# EAGLE design me433 (EAGLE 9.6.2)
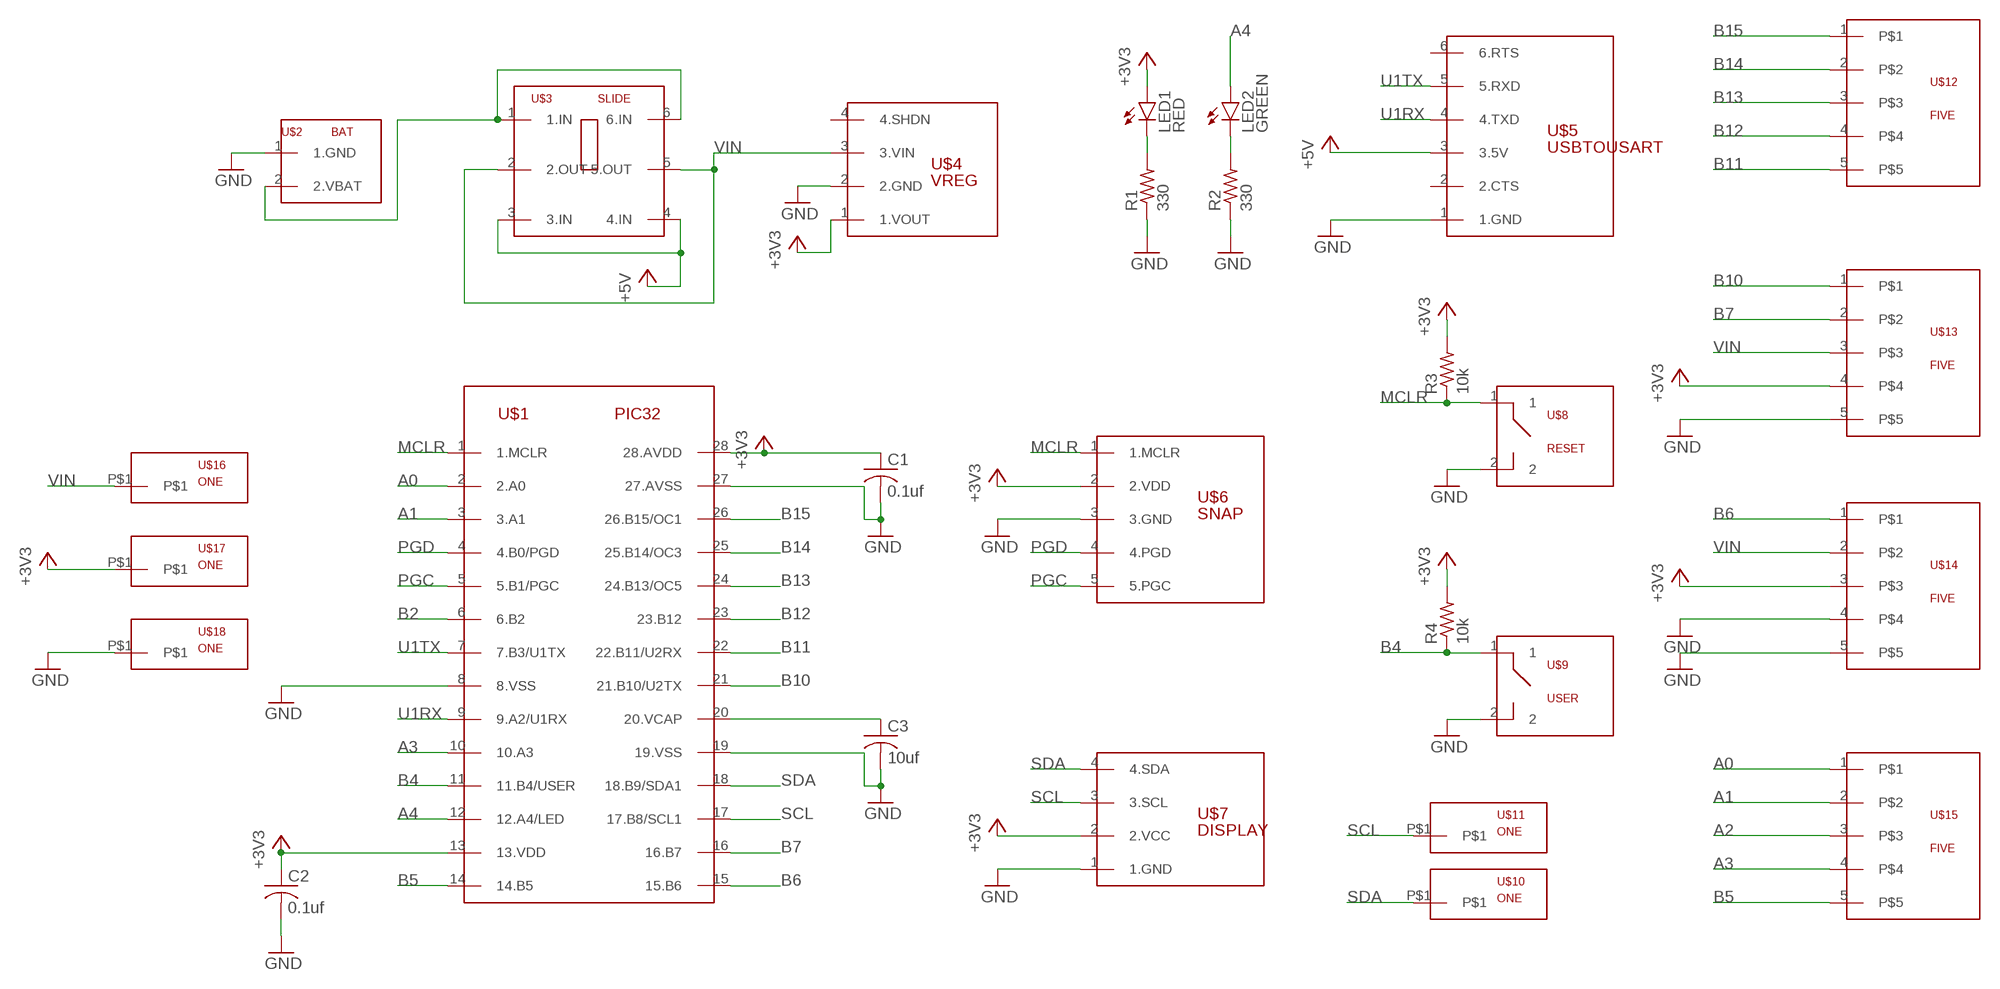
[diagram p0: schematic, sheet 1]

## Parts
C1  0.1uf  C-US025-024X044  [C025-024X044]
C2  0.1uf  C-US025-024X044  [C025-024X044]
C3  10uf  C-US025-024X044  [C025-024X044]
LED1  RED  LED3MM  [LED3MM]
LED2  GREEN  LED3MM  [LED3MM]
R1  330  R-US_0207/7  [0207/7]
R2  330  R-US_0207/7  [0207/7]
R3  10k  R-US_0207/7  [0207/7]
R4  10k  R-US_0207/7  [0207/7]
U$1  PIC32  [DIL28-3]
U$2  BAT  [BAT]
U$3  SLIDE  [SLIDE]
U$4  VREG  [VREG]
U$5  USBTOUSART  [USBTOUSART]
U$6  SNAP  [SNAP]
U$7  DISPLAY  [DISPLAY]
U$8  RESET  BUTTON  [BUTTON]
U$9  USER  BUTTON  [BUTTON]
U$10  ONE  [ONE]
U$11  ONE  [ONE]
U$12  FIVE  [FIVE]
U$13  FIVE  [FIVE]
U$14  FIVE  [FIVE]
U$15  FIVE  [FIVE]
U$16  ONE  [ONE]
U$17  ONE  [ONE]
U$18  ONE  [ONE]

## Nets
+3V3: C1.1 C2.1 LED1.A R3.2 R4.2 U$1.13(13.VDD) U$1.28(28.AVDD) U$4.1(1.VOUT) U$6.2(2.VDD) U$7.2(2.VCC) U$13.4 U$14.3 U$17.P$1
+5V: U$3.3(3.IN) U$3.4(4.IN) U$5.3(3.5V)
A0: U$1.2(2.A0) U$15.1
A1: U$1.3(3.A1) U$15.2
A2: U$15.3
A3: U$1.10(10.A3) U$15.4
A4: LED2.A U$1.12(12.A4/LED)
B2: U$1.6(6.B2)
B4: R4.1 U$1.11(11.B4/USER) U$9.1
B5: U$1.14(14.B5) U$15.5
B6: U$1.15(15.B6) U$14.1
B7: U$1.16(16.B7) U$13.2
B10: U$1.21(21.B10/U2TX) U$13.1
B11: U$1.22(22.B11/U2RX) U$12.5
B12: U$1.23(23.B12) U$12.4
B13: U$1.24(24.B13/OC5) U$12.3
B14: U$1.25(25.B14/OC3) U$12.2
B15: U$1.26(26.B15/OC1) U$12.1
GND: C1.2 C2.2 C3.2 R1.1 R2.1 U$1.8(8.VSS) U$1.19(19.VSS) U$1.27(27.AVSS) U$2.1(1.GND) U$4.2(2.GND) U$5.1(1.GND) U$6.3(3.GND) U$7.1(1.GND) U$8.2 U$9.2 U$13.5 U$14.4 U$14.5 U$18.P$1
MCLR: R3.1 U$1.1(1.MCLR) U$6.1(1.MCLR) U$8.1
N$1: U$2.2(2.VBAT) U$3.1(1.IN) U$3.6(6.IN)
N$2: LED1.K(C) R1.2
N$4: LED2.K(C) R2.2
N$5: C3.1 U$1.20(20.VCAP)
PGC: U$1.5(5.B1/PGC) U$6.5(5.PGC)
PGD: U$1.4(4.B0/PGD) U$6.4(4.PGD)
SCL: U$1.17(17.B8/SCL1) U$7.3(3.SCL) U$11.P$1
SDA: U$1.18(18.B9/SDA1) U$7.4(4.SDA) U$10.P$1
U1RX: U$1.9(9.A2/U1RX) U$5.4(4.TXD)
U1TX: U$1.7(7.B3/U1TX) U$5.5(5.RXD)
VIN: U$3.2(2.OUT) U$3.5(5.OUT) U$4.3(3.VIN) U$13.3 U$14.2 U$16.P$1
Unconnected: U$4.4(4.SHDN) U$5.2(2.CTS) U$5.6(6.RTS)

## Library data of the parts
C1-C3 = me433:C-US: CAPACITOR, American symbol; SPICEPREFIX: C
LED1 LED2 = me433:LED: LED OSRAM: - CHIPLED LG R971, LG N971, LY N971, LG Q971, LY Q971, LO R971, LY R971 LH N974, LH R974 LS Q976, LO Q976, LY Q976 LO Q996 - Hyper CHIPLED LW Q18S LB Q993, LB Q99A, LB R99A - SideLED LS A670, LO A670, LY A670, LG A670, LP A670 LB A673, LV A673, LT A673, LW A673 LH A674 LY A675 LS A676, LA A676, LO A676, LY A676, LW A676 LS A679, LY A679, LG A679 - Hyper Micro SIDELED® LS Y876, LA Y876, LO Y876, LY Y876 LT Y87S - SmartLED LW L88C, LW L88S LB L89C, LB L89S, LG L890 LS L89K, LO L89K, LY L89K LS L896, LA L896, LO L896, LY L896 - TOPLED LS T670, LO T670, LY T670, LG T670, LP T670 LSG T670, LSP T670, LSY T670, LOP T670, LYG T670 LG T671, LOG T671, LSG T671 LB T673, LV T673, LT T673, LW T673 LH T674 LS T676, LA T676, LO T676, LY T676, LB T676, LH T676, LSB T676, LW T676 LB T67C, LV T67C, LT T67C, LS T67K, LO T67K, LY T67K, LW E67C LS E67B, LA E67B, LO E67B, LY E67B, LB E67C, LV E67C, LT E67C LW T67C LS T679, LY T679, LG T679 LS T770, LO T770, LY T770, LG T770, LP T770 LB T773, LV T773, LT T773, LW T773 LH T774 LS E675, LA E675, LY E675, LS T675 LS T776, LA T776, LO T776, LY T776, LB T776 LHGB T686 LT T68C, LB T68C - Hyper Mini TOPLED® LB M676 - Mini TOPLED Santana® LG M470 LS M47K, LO M47K, LY M47K Source: http://www.osram.convergy.de LUXEON: - LUMILED® LXK2-PW12-R00, LXK2-PW12-S00, LXK2-PW14-U00, LXK2-PW14-V00 LXK2-PM12-R00, LXK2-PM12-S00, LXK2-PM14-U00 LXK2-PE12-Q00, LXK2-PE12-R00, LXK2-PE12-S00, LXK2-PE14-T00, LXK2-PE14-U00 LXK2-PB12-K00, LXK2-PB12-L00, LXK2-PB12-M00, LXK2-PB14-N00, LXK2-PB14-P00, LXK2-PB14-Q00 LXK2-PR12-L00, LXK2-PR12-M00, LXK2-PR14-Q00, LXK2-PR14-R00 LXK2-PD12-Q00, LXK2-PD12-R00, LXK2-PD12-S00 LXK2-PH12-R00, LXK2-PH12-S00 LXK2-PL12-P00, LXK2-PL12-Q00, LXK2-PL12-R00 Source: www.luxeon.com KINGBRIGHT: KA-3528ASYC Source: www.kingbright.com
R1-R4 = me433:R-US_: RESISTOR, American symbol; SPICEPREFIX: R
U$1 = me433:PIC32
U$2 = me433:BAT
U$3 = me433:SLIDE
U$4 = me433:VREG
U$5 = me433:USBTOUSART
U$6 = me433:SNAP
U$7 = me433:DISPLAY
U$8 U$9 = me433:BUTTON
U$10 U$11 U$16-U$18 = me433:ONE
U$12-U$15 = me433:FIVE

## Board
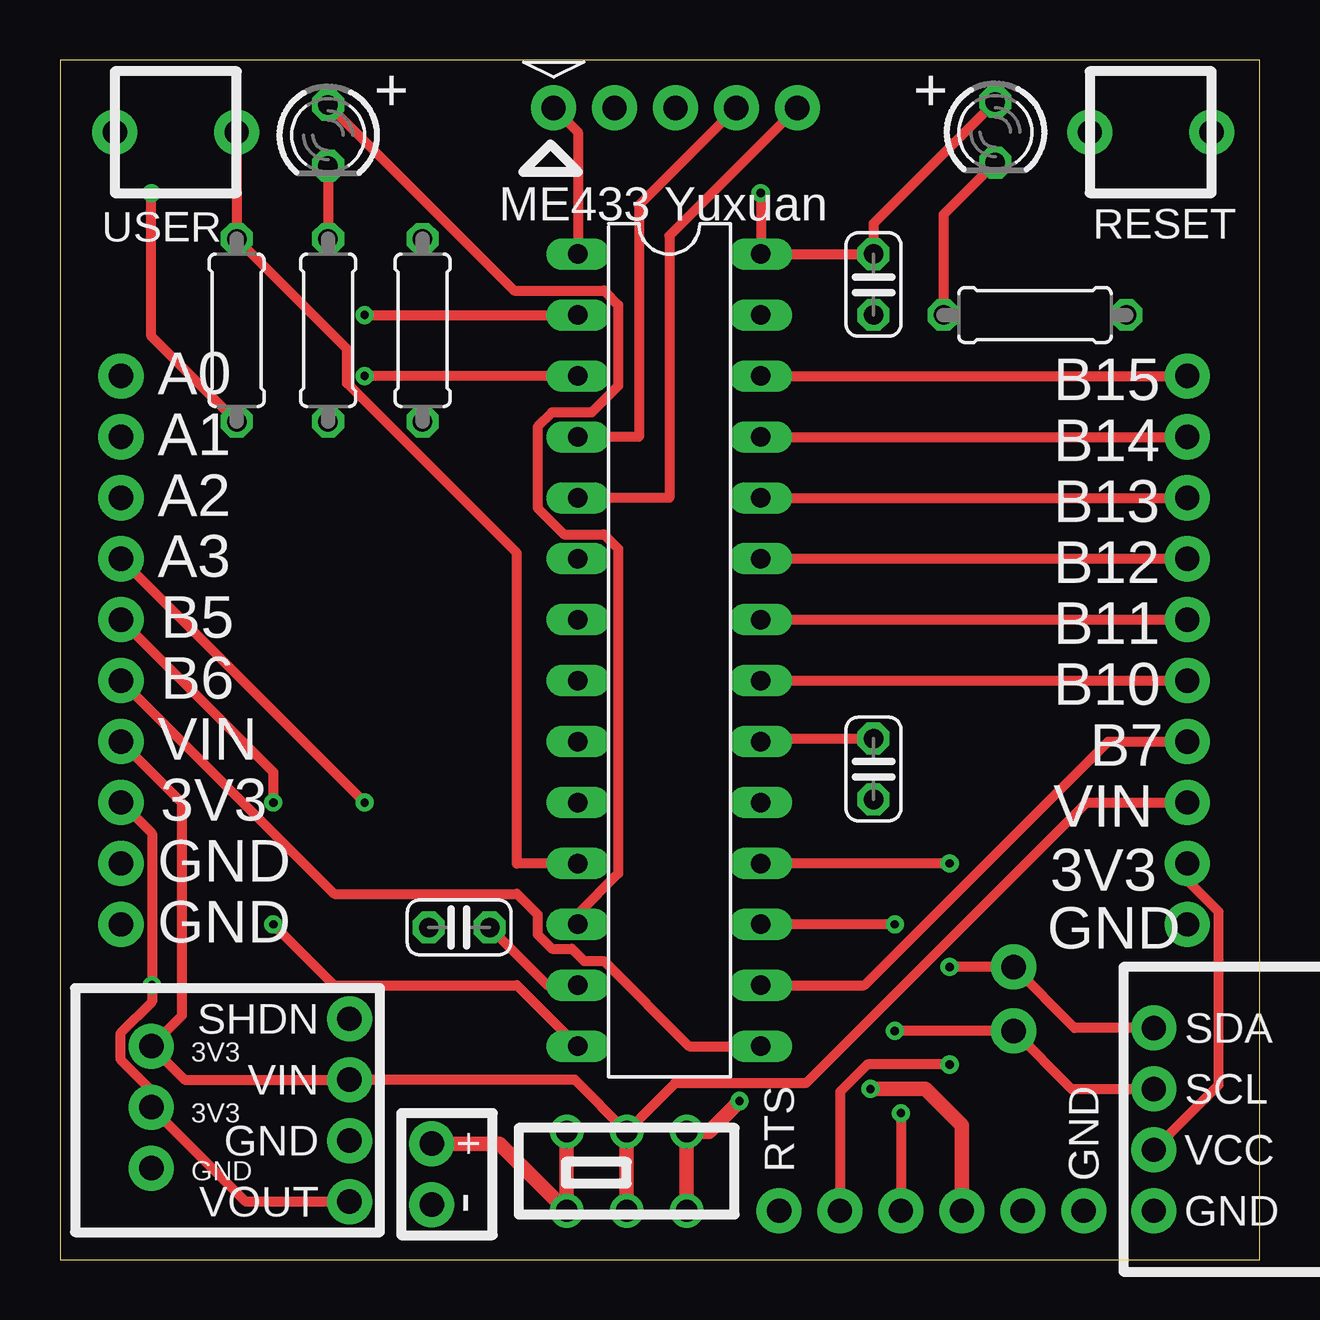
[diagram p1: board, top side]
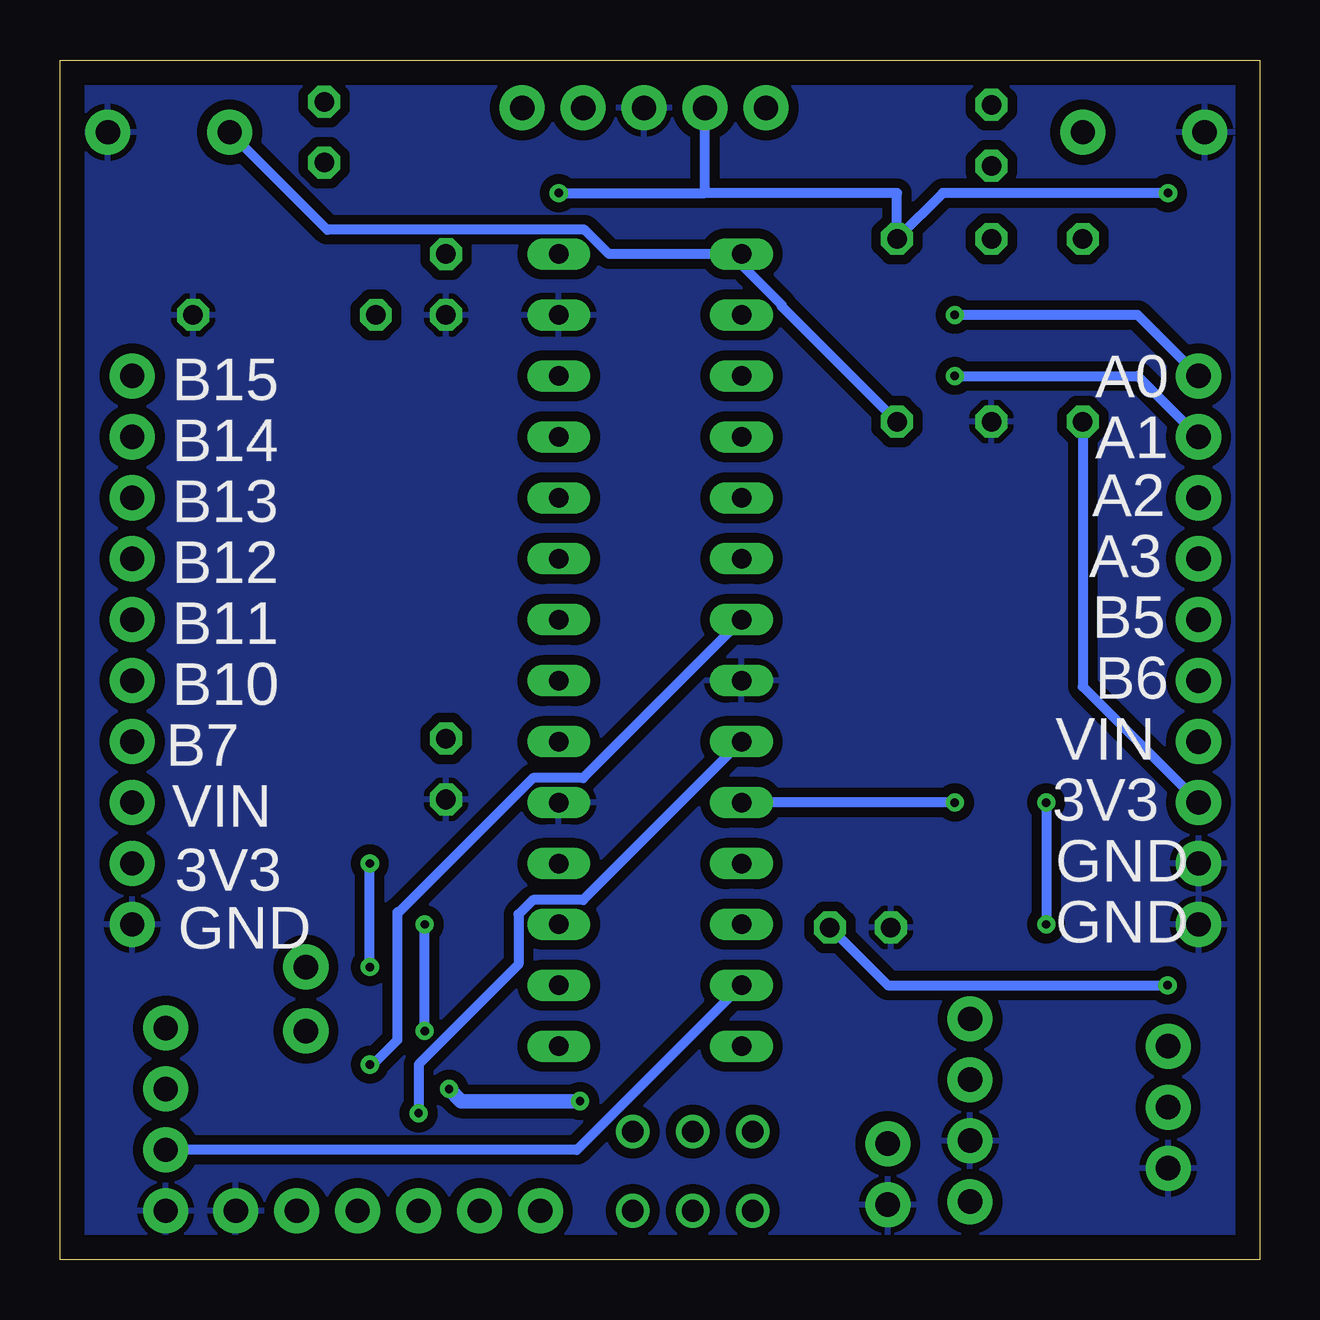
[diagram p2: board, bottom side, seen from below]

Size 50 x 50 mm. Coordinates in mm from the lower left corner, seen from the top.
Outline: 0,0 50,0 50,50 0,50 0,0
Copper layers (1*16): Top 0.035mm / dielectric 1.5mm / Bottom 0.035mm
Design rules "default": minimum track width 6mil, minimum drill 0.35mm, track to track 6mil, track to pad 6mil, pad to pad 6mil, via to via 6mil, smd to smd 6mil, copper to edge 40mil, drill to drill 6mil, minimum pad ring 10mil, minimum via ring 8mil, stop-mask expansion 4mil, vias tented up to drill 0mil, thermal gap 10mil

### Footprints (pad centres in the part's own frame; a part is rotated, then mirrored left to right if it is on the bottom)
C025-024X044 = drill 0.813 octagon: 1 -1.27,0; 2 1.27,0
LED3MM = drill 0.813 octagon: A -1.27,0; K 1.27,0
0207/7 = drill 0.813 octagon: 1 -3.81,0; 2 3.81,0
DIL28-3 = drill 0.813 long: 1 -16.51,-3.81; 2 -13.97,-3.81; 3 -11.43,-3.81; 4 -8.89,-3.81; 5 -6.35,-3.81; 6 -3.81,-3.81; 7 -1.27,-3.81; 8 1.27,-3.81; 9 3.81,-3.81; 10 6.35,-3.81; 11 8.89,-3.81; 12 11.43,-3.81; 13 13.97,-3.81; 14 16.51,-3.81; 15 16.51,3.81; 16 13.97,3.81; 17 11.43,3.81; 18 8.89,3.81; 19 6.35,3.81; 20 3.81,3.81; 21 1.27,3.81; 22 -1.27,3.81; 23 -3.81,3.81; 24 -6.35,3.81; 25 -8.89,3.81; 26 -11.43,3.81; 27 -13.97,3.81; 28 -16.51,3.81
BAT = drill 1.016 pad 1.88: 1 -1.27,0; 2 1.27,0
SLIDE = drill 0.9: 1 -2.5,-1.65; 2 0,-1.65; 3 2.5,-1.65; 4 2.5,1.65; 5 0,1.65; 6 -2.5,1.65
VREG = drill 1.016 pad 1.88: 1 -3.81,0; 2 -1.27,0; 3 1.27,0; 4 3.81,0
USBTOUSART = drill 1.016 pad 1.88: 1 -6.35,0; 2 -3.81,0; 3 -1.27,0; 4 1.27,0; 5 3.81,0; 6 6.35,0
SNAP = drill 1.016 pad 1.88: 1 -5.08,0; 2 -2.54,0; 3 0,0; 4 2.54,0; 5 5.08,0
DISPLAY = drill 1.016 pad 1.88: 1 0,-3.81; 2 0,-1.27; 3 0,1.27; 4 0,3.81
BUTTON = drill 1.016 pad 1.88: 1 -2.54,0; 2 2.54,0
ONE = drill 1.016 pad 1.88: P$1 0,0
FIVE = drill 1.016 pad 1.88: 1 -5.08,0; 2 -2.54,0; 3 0,0; 4 2.54,0; 5 5.08,0

### Placement (x,y rotation side)
C1  33.91,40.64 270 top
C2  16.64,13.84 180 top
C3  33.91,20.45 270 top
LED1  38.99,46.99 270 top
LED2  11.18,46.86 270 top
R1  40.64,39.37 180 top
R2  11.18,38.73 90 top
R3  15.11,38.73 90 top
R4  7.37,38.73 270 top
U$1  25.4,25.4 270 top
U$2  15.49,3.56 90 top
U$3  23.62,3.68 0 top
U$4  12.06,6.22 90 top
U$5  36.32,2.03 180 top
U$6  25.65,48.01 0 top
U$7  45.59,5.84 0 top
U$8  45.47,46.99 0 top
U$9  4.83,46.99 180 top
U$10  39.75,12.19 0 top
U$11  39.75,9.53 0 top
U$12  46.99,31.75 270 top
U$13  46.99,19.05 270 top
U$14  2.54,19.05 270 top
U$15  2.54,31.75 270 top
U$16  3.81,8.89 0 top
U$17  3.81,6.35 0 top
U$18  3.81,3.81 0 top

### Tracks (layer width: path | path; a pad name or v marks a point on that pad's centre or on a via)
+3V3  (via drill 0.35)
  Top 0.406: LED1.A 33.91,43.18 C1.1 U$1.28 v29.21,44.45 | U$4.1 7.75,2.41 U$17.P$1 3.81,7.06 2.52,8.35 2.52,9.43 3.83,10.75 v3.83,11.43 3.83,17.75 U$14.3 | C2.1 20.32,11.43 U$1.13 | U$13.4 46.99,15.8 48.28,14.51 48.28,7.26 U$7.2 | R4.2 3.81,38.48 v3.81,44.45
  Bottom 0.406: C2.1 15.49,11.43 v3.83,11.43 3.81,11.43 | R4.2 7.37,23.88 U$14.3 | U$1.13 28.45,4.57 U$7.2 | v3.81,44.45 13.21,44.45 R3.2 15.11,44.45 23.11,44.45 | 23.11,44.45 U$6.2 | v29.21,44.45 23.11,44.45
+5V  (via drill 0.35)
  Top 0.61: U$3.3 U$3.4 27.05,5.33 v28.32,6.6 | U$5.3 37.59,5.59 36.07,7.11 v33.78,7.11
  Bottom 0.61: v33.78,7.11 33.27,6.6 v28.32,6.6
A0  (via drill 0.35)
  Top 0.406: v12.7,39.37 U$1.2
  Bottom 0.406: U$15.1 5.08,39.37 v12.7,39.37
A1  (via drill 0.35)
  Top 0.406: U$1.3 v12.7,36.83
  Bottom 0.406: v12.7,36.83 5.08,36.83 U$15.2
A3  (via drill 0.35)
  Top 0.406: U$15.4 v12.7,19.05
  Bottom 0.406: v12.7,19.05 U$1.10
A4
  Top 0.406: U$1.12 21.59,14.41 23.27,16.09 23.27,29.63 22.67,30.23 21.02,30.23 19.91,31.33 19.91,34.71 20.51,35.31 22.16,35.31 23.27,36.41 23.27,39.79 22.67,40.39 18.92,40.39 LED2.A
B4
  Top 0.406: U$9.1 R4.1 11.97,37.95 11.97,36.53 19.05,29.44 19.05,16.51 U$1.11
B5  (via drill 0.35)
  Top 0.406: U$15.5 8.89,20.32 v8.89,19.05 | v8.89,13.97 11.43,11.43 19.05,11.43 U$1.14
  Bottom 0.406: v8.89,19.05 v8.89,13.97
B6
  Top 0.406: U$14.1 11.43,15.24 19.05,15.24 19.91,14.38 19.91,13.55 20.51,12.95 21.34,12.95 21.84,12.45 22.67,12.45 26.23,8.89 U$1.15
B7
  Top 0.406: U$1.16 33.53,11.43 43.69,21.59 U$13.2
B10
  Top 0.406: U$1.21 U$13.1
B11
  Top 0.406: U$1.22 U$12.5
B12
  Top 0.406: U$1.23 U$12.4
B13
  Top 0.406: U$1.24 U$12.3
B14
  Top 0.406: U$1.25 U$12.2
B15
  Top 0.406: U$1.26 U$12.1
GND
  pour Bottom (isolate 0.406): 0,0 50.8,0 50.8,50.8 0,50.8
MCLR
  Top 0.406: U$6.1 21.59,46.99 U$1.1
  Bottom 0.406: U$8.1 38.86,42.93 28.13,42.93 27.11,41.91 U$1.1 21.59,41.47 19.91,39.79 19.91,39.73 R3.1
N$1
  Top 0.61: U$3.6 U$3.1 18.33,4.83 U$2.2
N$2
  Top 0.406: LED1.K 36.83,43.56 R1.2
N$4
  Top 0.406: LED2.K R2.2
N$5
  Top 0.406: U$1.20 29.34,21.72 C3.1
PGC
  Top 0.406: U$6.5 25.4,42.67 25.4,31.75 U$1.5
PGD
  Top 0.406: U$6.4 24.13,43.94 24.13,34.29 U$1.4
SCL  (via drill 0.35)
  Top 0.406: U$7.3 42.16,7.11 U$11.P$1 v34.8,9.53 | v34.8,13.97 U$1.17
  Bottom 0.406: v34.8,9.53 v34.8,13.97
SDA  (via drill 0.35)
  Top 0.406: U$7.4 42.29,9.65 U$10.P$1 v37.08,12.19 | v37.08,16.51 U$1.18
  Bottom 0.406: v37.08,12.19 v37.08,16.51
U1RX  (via drill 0.35)
  Top 0.406: v35.05,6.1 U$5.4
  Bottom 0.406: v35.05,6.1 35.05,8.13 30.89,12.29 30.89,14.39 30.29,14.99 28.19,14.99 U$1.9
U1TX  (via drill 0.35)
  Top 0.406: v37.08,8.13 33.66,8.13 32.51,6.99 U$5.5
  Bottom 0.406: U$1.7 28.19,20.07 30.29,20.07 35.88,14.48 35.94,14.48 35.94,9.14 36.96,8.13 v37.08,8.13
VIN
  Top 0.406: U$14.2 5.08,19.05 5.08,10.16 U$16.P$1 5.21,7.49 U$4.3 21.46,7.49 U$3.5 25.66,7.37 31.11,7.37 42.8,19.05 U$13.3
  Top 0.61: U$3.5 U$3.2

### Text on the board
tPlace: + | + | ME433 Yuxuan | A0 | B15 | A1 | B14 | A2 | B13 | A3 | B12 | B5 | B11 | B6 | B10 | VIN | B7 | 3V3 | VIN | GND | 3V3 | GND | GND | 3V3 | 3V3 | GND
bPlace: A0 | B15 | A1 | B14 | A2 | B13 | A3 | B12 | B5 | B11 | B6 | B10 | VIN | B7 | 3V3 | VIN | GND | 3V3 | GND | GND